# Altium schematic sheet atxmega128a1.SchDoc
size A3
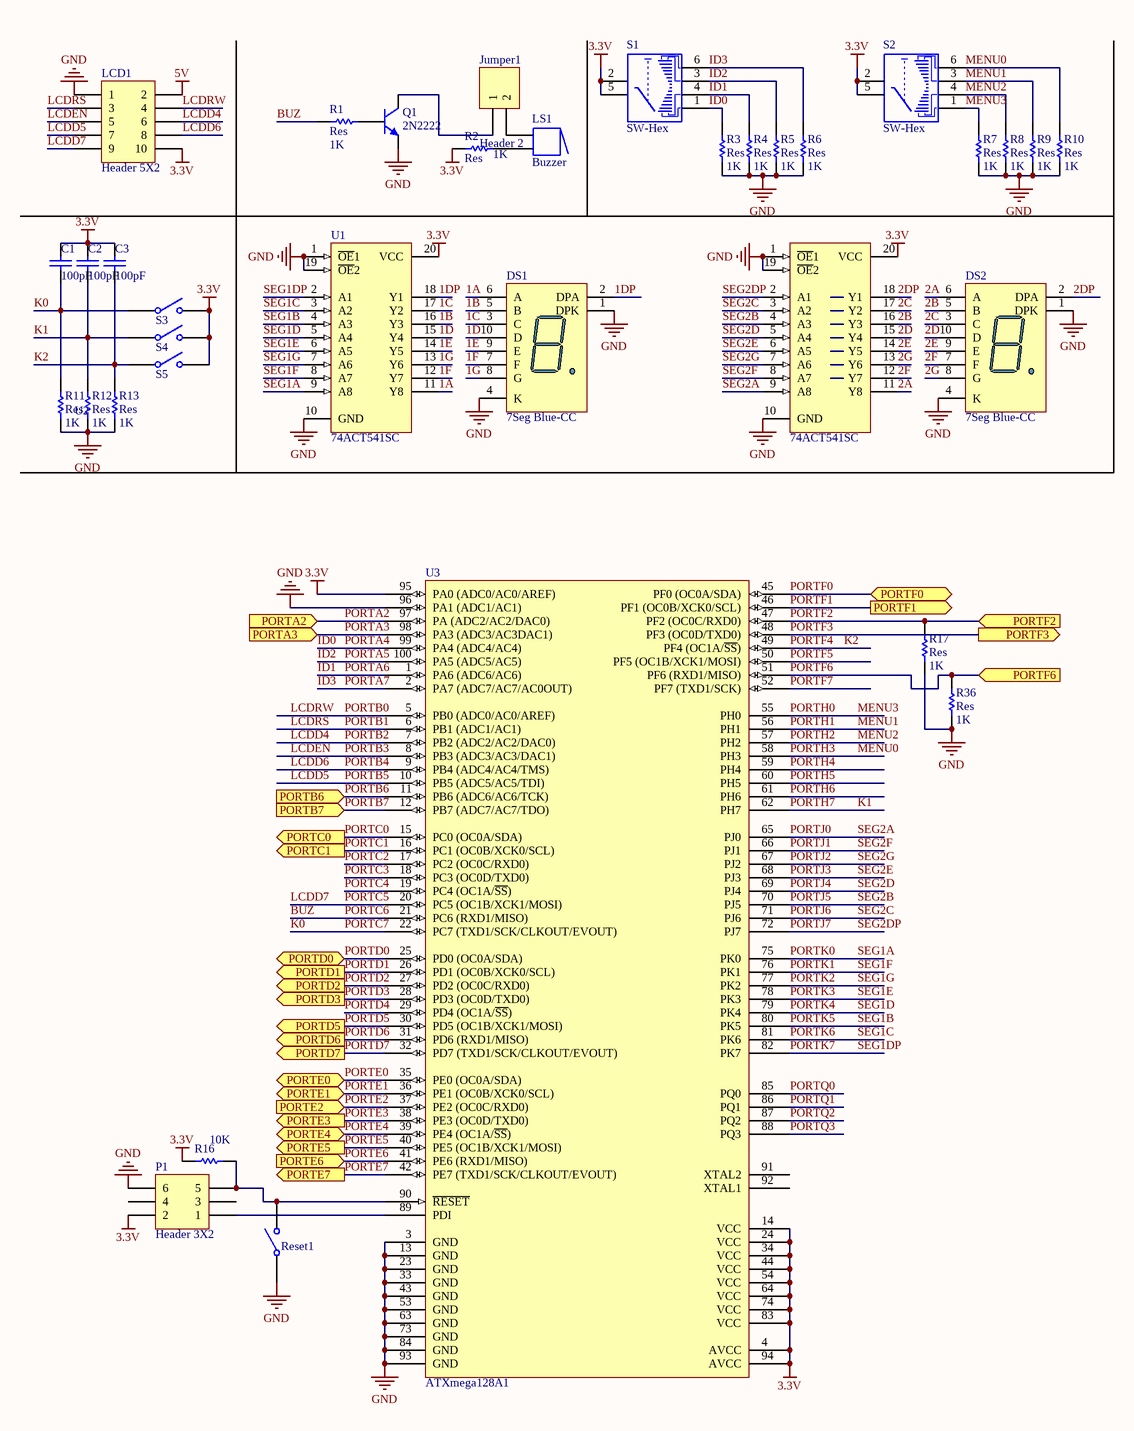
[diagram p0: atxmega128a1.SchDoc]

## Parts
C1  value 100pF  [2012[0805]]  (hidden comment: Cap_UP)
C2  value 100pF  [2012[0805]]  (hidden comment: Cap_UP)
C3  value 100pF  [2012[0805]]  (hidden comment: Cap_UP)
DS1  7Seg Blue-CC  [7Segment Small]
DS2  7Seg Blue-CC  [7Segment Small]
Jumper1  Header 2  [HDR1X2]
LCD1  Header 5X2  [HDRBOX2X5]
LS1  Buzzer  [BUZZER]
P1  Header 3X2  [HDRBOX2X3]
Q1  2N2222  [SOT-23]
R1  Res  value 1K  [2012[0805]]
R2  Res  value 1K  [2012[0805]]
R3  Res  value 1K  [2012[0805]]
R4  Res  value 1K  [2012[0805]]
R5  Res  value 1K  [2012[0805]]
R6  Res  value 1K  [2012[0805]]
R7  Res  value 1K  [2012[0805]]
R8  Res  value 1K  [2012[0805]]
R9  Res  value 1K  [2012[0805]]
R10  Res  value 1K  [2012[0805]]
R11  Res  value 1K  [2012[0805]]
R12  Res  value 1K  [2012[0805]]
R13  Res  value 1K  [2012[0805]]
R16  10K  [2012[0805]]
R17  Res  value 1K  [2012[0805]]
R36  Res  value 1K  [2012[0805]]
Reset1  SW-SPST  [PUSH-BUT]  (value not drawn)
S1  SW-Hex  [SW-HEX]
S2  SW-Hex  [SW-HEX]
S3  SW-SPST  [PUSH-BUT]  (value not drawn)
S4  SW-SPST  [PUSH-BUT]  (value not drawn)
S5  SW-SPST  [PUSH-BUT]  (value not drawn)
U1  74ACT541SC  [M20B_M]
U2  74ACT541SC  [M20B_M]
U3  ATXmega128A1  [100A_N]

## Ports
PORTA2 (in), PORTA3 (in), PORTB6 (in), PORTB7 (in), PORTC0 (out), PORTC1 (out), PORTD0, PORTD1 (out), PORTD2 (out), PORTD3 (out), PORTD5 (out), PORTD6 (out), PORTD7 (out), PORTE0, PORTE1, PORTE2 (in), PORTE3 (out), PORTE4, PORTE5 (out), PORTE6 (in), PORTE7 (out), PORTF0, PORTF1 (out), PORTF2 (in), PORTF3 (out), PORTF6 (in)

## Nets
3.3V: C1.2 C2.2 C3.2 LCD1.10 P1.2 R2.1 R16.1 S1.2 S1.5 S2.2 S2.5 S3.2(NO) S4.2(NO) S5.2(NO) U1.20(VCC) U2.20(VCC) U3.4(AVCC) U3.14(VCC) U3.24(VCC) U3.34(VCC) U3.44(VCC) U3.54(VCC) U3.64(VCC) U3.74(VCC) U3.83(VCC) U3.94(AVCC) U3.95(PA0_(ADC0/AC0/AREF))
5V: LCD1.2
GND: DS1.1(DPK) DS1.4(K) DS2.1(DPK) DS2.4(K) LCD1.1 P1.6 Q1.3(E) R3.1 R4.1 R5.1 R6.1 R7.1 R8.1 R9.1 R10.1 R11.2 R12.2 R13.2 R17.1 R36.1 Reset1.1(COMMON) U1.1(~{OE}1) U1.10(GND) U1.19(~{OE}2) U2.1(~{OE}1) U2.10(GND) U2.19(~{OE}2) U3.3(GND) U3.13(GND) U3.23(GND) U3.33(GND) U3.43(GND) U3.53(GND) U3.63(GND) U3.73(GND) U3.84(GND) U3.93(GND) U3.96(PA1_(ADC1/AC1))
1A: DS1.6(A) U1.11(Y8)
1B: DS1.5(B) U1.16(Y3)
1C: DS1.3(C) U1.17(Y2)
1D: DS1.10(D) U1.15(Y4)
1DP: DS1.2(DPA) U1.18(Y1)
1E: DS1.9(E) U1.14(Y5)
1F: DS1.7(F) U1.12(Y7)
1G: DS1.8(G) U1.13(Y6)
2A: DS2.6(A) U2.11(Y8)
2B: DS2.5(B) U2.16(Y3)
2C: DS2.3(C) U2.17(Y2)
2D: DS2.10(D) U2.15(Y4)
2DP: DS2.2(DPA) U2.18(Y1)
2E: DS2.9(E) U2.14(Y5)
2F: DS2.7(F) U2.12(Y7)
2G: DS2.8(G) U2.13(Y6)
BUZ: R1.1 U3.21(PC6_(RXD1/MISO))  [also labelled PORTC6]
ID0: R3.2 S1.1 U3.99(PA4_(ADC4/AC4))  [also labelled PORTA4]
ID1: R4.2 S1.4 U3.1(PA6_(ADC6/AC6))  [also labelled PORTA6]
ID2: R5.2 S1.3 U3.100(PA5_(ADC5/AC5))  [also labelled PORTA5]
ID3: R6.2 S1.6 U3.2(PA7_(ADC7/AC7/AC0OUT))  [also labelled PORTA7]
K0: C1.1 R11.1 S3.1(COMMON) U3.22(PC7_(TXD1/SCK/CLKOUT/EVOUT))  [also labelled PORTC7]
K1: C2.1 R12.1 S4.1(COMMON) U3.62(PH7)  [also labelled PORTH7]
K2: C3.1 R13.1 S5.1(COMMON) U3.49(PF4_(OC1A/~{SS}))  [also labelled PORTF4]
LCDD4: LCD1.6 U3.7(PB2_(ADC2/AC2/DAC0))  [also labelled PORTB2]
LCDD5: LCD1.7 U3.10(PB5_(ADC5/AC5/TDI))  [also labelled PORTB5]
LCDD6: LCD1.8 U3.9(PB4_(ADC4/AC4/TMS))  [also labelled PORTB4]
LCDD7: LCD1.9 U3.20(PC5_(OC1B/XCK1/MOSI))  [also labelled PORTC5]
LCDEN: LCD1.5 U3.8(PB3_(ADC3/AC3/DAC1))  [also labelled PORTB3]
LCDRS: LCD1.3 U3.6(PB1_(ADC1/AC1))  [also labelled PORTB1]
LCDRW: LCD1.4 U3.5(PB0_(ADC0/AC0/AREF))  [also labelled PORTB0]
MENU0: R10.2 S2.6 U3.58(PH3)  [also labelled PORTH3]
MENU1: R9.2 S2.3 U3.56(PH1)  [also labelled PORTH1]
MENU2: R8.2 S2.4 U3.57(PH2)  [also labelled PORTH2]
MENU3: R7.2 S2.1 U3.55(PH0)  [also labelled PORTH0]
PORTA2: U3.97(PA_(ADC2/AC2/DAC0)) ; port PORTA2
PORTA3: U3.98(PA3_(ADC3/AC3DAC1)) ; port PORTA3
PORTB6: U3.11(PB6_(ADC6/AC6/TCK)) ; port PORTB6
PORTB7: U3.12(PB7_(ADC7/AC7/TDO)) ; port PORTB7
PORTC0: U3.15(PC0_(OC0A/SDA)) ; port PORTC0
PORTC1: U3.16(PC1_(OC0B/XCK0/SCL)) ; port PORTC1
PORTC2: U3.17(PC2_(OC0C/RXD0))
PORTC3: U3.18(PC3_(OC0D/TXD0))
PORTC4: U3.19(PC4_(OC1A/~{SS}))
PORTD0: U3.25(PD0_(OC0A/SDA)) ; port PORTD0
PORTD1: U3.26(PD1_(OC0B/XCK0/SCL)) ; port PORTD1
PORTD2: U3.27(PD2_(OC0C/RXD0)) ; port PORTD2
PORTD3: U3.28(PD3_(OC0D/TXD0)) ; port PORTD3
PORTD4: U3.29(PD4_(OC1A/~{SS}))
PORTD5: U3.30(PD5_(OC1B/XCK1/MOSI)) ; port PORTD5
PORTD6: U3.31(PD6_(RXD1/MISO)) ; port PORTD6
PORTD7: U3.32(PD7_(TXD1/SCK/CLKOUT/EVOUT)) ; port PORTD7
PORTE0: U3.35(PE0_(OC0A/SDA)) ; port PORTE0
PORTE1: U3.36(PE1_(OC0B/XCK0/SCL)) ; port PORTE1
PORTE2: U3.37(PE2_(OC0C/RXD0)) ; port PORTE2
PORTE3: U3.38(PE3_(OC0D/TXD0)) ; port PORTE3
PORTE4: U3.39(PE4_(OC1A/~{SS})) ; port PORTE4
PORTE5: U3.40(PE5_(OC1B/XCK1/MOSI)) ; port PORTE5
PORTE6: U3.41(PE6_(RXD1/MISO)) ; port PORTE6
PORTE7: U3.42(PE7_(TXD1/SCK/CLKOUT/EVOUT)) ; port PORTE7
PORTF0: U3.45(PF0_(OC0A/SDA)) ; port PORTF0
PORTF1: U3.46(PF1_(OC0B/XCK0/SCL)) ; port PORTF1
PORTF2: R17.2 U3.47(PF2_(OC0C/RXD0)) ; port PORTF2
PORTF3: U3.48(PF3_(OC0D/TXD0)) ; port PORTF3
PORTF5: U3.50(PF5_(OC1B/XCK1/MOSI))
PORTF6: R36.2 U3.51(PF6_(RXD1/MISO)) ; port PORTF6
PORTF7: U3.52(PF7_(TXD1/SCK))
PORTH4: U3.59(PH4)
PORTH5: U3.60(PH5)
PORTH6: U3.61(PH6)
PORTJ0: U2.9(A8) U3.65(PJ0)  [also labelled SEG2A]
PORTJ1: U2.8(A7) U3.66(PJ1)  [also labelled SEG2F]
PORTJ2: U2.7(A6) U3.67(PJ2)  [also labelled SEG2G]
PORTJ3: U2.6(A5) U3.68(PJ3)  [also labelled SEG2E]
PORTJ4: U2.5(A4) U3.69(PJ4)  [also labelled SEG2D]
PORTJ5: U2.4(A3) U3.70(PJ5)  [also labelled SEG2B]
PORTJ6: U2.3(A2) U3.71(PJ6)  [also labelled SEG2C]
PORTJ7: U2.2(A1) U3.72(PJ7)  [also labelled SEG2DP]
PORTK0: U1.9(A8) U3.75(PK0)  [also labelled SEG1A]
PORTK1: U1.8(A7) U3.76(PK1)  [also labelled SEG1F]
PORTK2: U1.7(A6) U3.77(PK2)  [also labelled SEG1G]
PORTK3: U1.6(A5) U3.78(PK3)  [also labelled SEG1E]
PORTK4: U1.5(A4) U3.79(PK4)  [also labelled SEG1D]
PORTK5: U1.4(A3) U3.80(PK5)  [also labelled SEG1B]
PORTK6: U1.3(A2) U3.81(PK6)  [also labelled SEG1C]
PORTK7: U1.2(A1) U3.82(PK7)  [also labelled SEG1DP]
PORTQ0: U3.85(PQ0)
PORTQ1: U3.86(PQ1)
PORTQ2: U3.87(PQ2)
PORTQ3: U3.88(PQ3)
NetJumper1_1: Jumper1.1 Q1.1(C)
NetJumper1_2: Jumper1.2 LS1.1
NetLS1_2: LS1.2 R2.2
NetP1_1: P1.1 U3.89(PDI)
NetP1_5: P1.5 R16.2 Reset1.2(NO) U3.90(~{RESET})
NetQ1_2: Q1.2(B) R1.2

Not connected (* = marked no-connect by the designer): P1 3 4; U3 91(XTAL2) 92(XTAL1)

## Library data of the parts
C1-C3 = Cap_UP: Capacitor; Published: 8-Jun-2000; LatestRevisionDate: 17-Jul-2002; LatestRevisionNote: Re-released for DXP Platform.; PackageReference: RAD-0.3; Publisher: Altium Limited
DS1 DS2 = 7Seg Blue-CC_1: 14.2 mm General Purpose Blue 7-Segment Display: CC, RH DP, Gray Surface; MinimumIntensity: 2020 ucd; Note: IF = 10 mA; Published: 8-Jun-2000; LatestRevisionDate: 17-Dec-2003; LatestRevisionNote: Schematic revised, PCB Footprint replaced.; DatasheetDocument: 24-Sep-2002; PackageDocument: 24-Sep-2002; PackageReference: H; Publisher: Altium Limited; Colour: Blue; ComponentLink1Description: Manufacturer Link; ComponentLink1URL: http://www.agilent.com/
Jumper1 = Header 2: Header, 2-Pin; LatestRevisionDate: 17-Jul-2002; LatestRevisionNote: Re-released for DXP Platform.; Publisher: Altium Limited
LCD1 = Header 5X2: Header, 5-Pin, Dual row; LatestRevisionDate: 17-Jul-2002; LatestRevisionNote: Re-released for DXP Platform.; Publisher: Altium Limited
LS1 = Buzzer: Magnetic Transducer Buzzer; Published: 24-Mar-1999; LatestRevisionDate: 17-Dec-2003; LatestRevisionNote: Schematic revised, PCB Footprint replaced.; DatasheetDocument: 17-Dec-2003; PackageReference: ABSM-1574; Publisher: Altium Limited; ComponentLink1Description: Manufacturer Link; ComponentLink1URL: http://www.megastar.com/linecard/buzzmode/index.php
P1 = Header 3X2: Header, 3-Pin, Dual row; LatestRevisionDate: 17-Jul-2002; LatestRevisionNote: Re-released for DXP Platform.; Publisher: Altium Limited
Q1 = 2N2222: NPN Bipolar Transistor; Published: 8-Jun-2000; LatestRevisionDate: 17-Jul-2002; LatestRevisionNote: Re-released for DXP Platform.; PackageReference: TO-226; Publisher: Altium Limited; Code_JEDEC: TO-226-AA
R1-R13 R16 R17 R36 = Res: Semiconductor Resistor; Published: 8-Jun-2000; LatestRevisionDate: 17-Jul-2002; LatestRevisionNote: Re-released for DXP Platform.; PackageReference: AXIAL-0.5; Publisher: Altium Limited
Reset1 S3-S5 = SW-SPST: Single-Pole, Single-Throw Switch; Published: 24-Mar-1999; Revision: July-2002: Re-released for DXP Platform.; Publisher: Altium Limited
U1 U2 = 74ACT541SC: Octal Buffer/Line Driver with 3-State Output; Published: 17-Jul-2002; LatestRevisionDate: 13-Apr-2006; LatestRevisionNote: IPC-7351 Footprint Added.; DatasheetVersion: Oct-1999; PackageVersion: 2000; PackageReference: M20B; Publisher: Altium Limited; PackageDescription: 20-Pin Small Outline Integrated Circuit 1.27 mm Pitch; Code_JEDEC: MS-013-AC; Code_IPC: SOIC127P1030-20; ComponentLink1Description: Manufacturer Link; ComponentLink1URL: http://www.fairchildsemi.com/; ComponentLink2Description: Datasheet; ComponentLink2URL: http://www.fairchildsemi.com/ds/74%2F74AC541.pdf
S1 S2 = SW-Hex: Published: 24-Mar-1999; LatestRevisionDate: 17-Jul-2002; LatestRevisionNote: Re-released for DXP Platform.; PackageReference: DIP-8; Publisher: Altium Limited